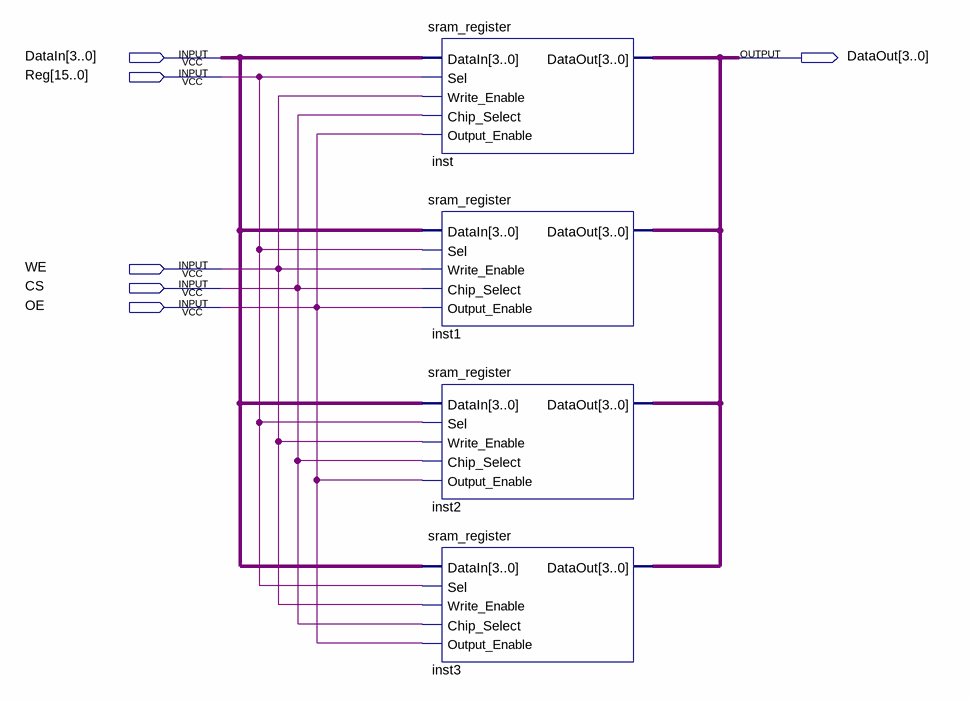
[diagram p0: schematic sheet]
// Quartus schematic sram16.bdf as structural Verilog: 4 symbols, 6 pins
module sram16 (
  input  [3:0] DataIn,
  input  [15:0] Reg,
  input  WE,
  input  CS,
  input  OE,
  output [3:0] DataOut
);

  wire undriven;

  sram_register inst (
    .DataIn(DataIn), .Sel(undriven), .Write_Enable(WE), .Chip_Select(CS), .Output_Enable(OE),
    .DataOut(DataOut));
  sram_register inst1 (
    .DataIn(DataIn), .Sel(undriven), .Write_Enable(WE), .Chip_Select(CS), .Output_Enable(OE),
    .DataOut(DataOut));
  sram_register inst2 (
    .DataIn(DataIn), .Sel(undriven), .Write_Enable(WE), .Chip_Select(CS), .Output_Enable(OE),
    .DataOut(DataOut));
  sram_register inst3 (
    .DataIn(DataIn), .Sel(undriven), .Write_Enable(WE), .Chip_Select(CS), .Output_Enable(OE),
    .DataOut(DataOut));
endmodule
